# EAGLE design hd6303-mb-ram-rom-x1-ext-dec (EAGLE 9.6.2)

## Sheet 1 of 2
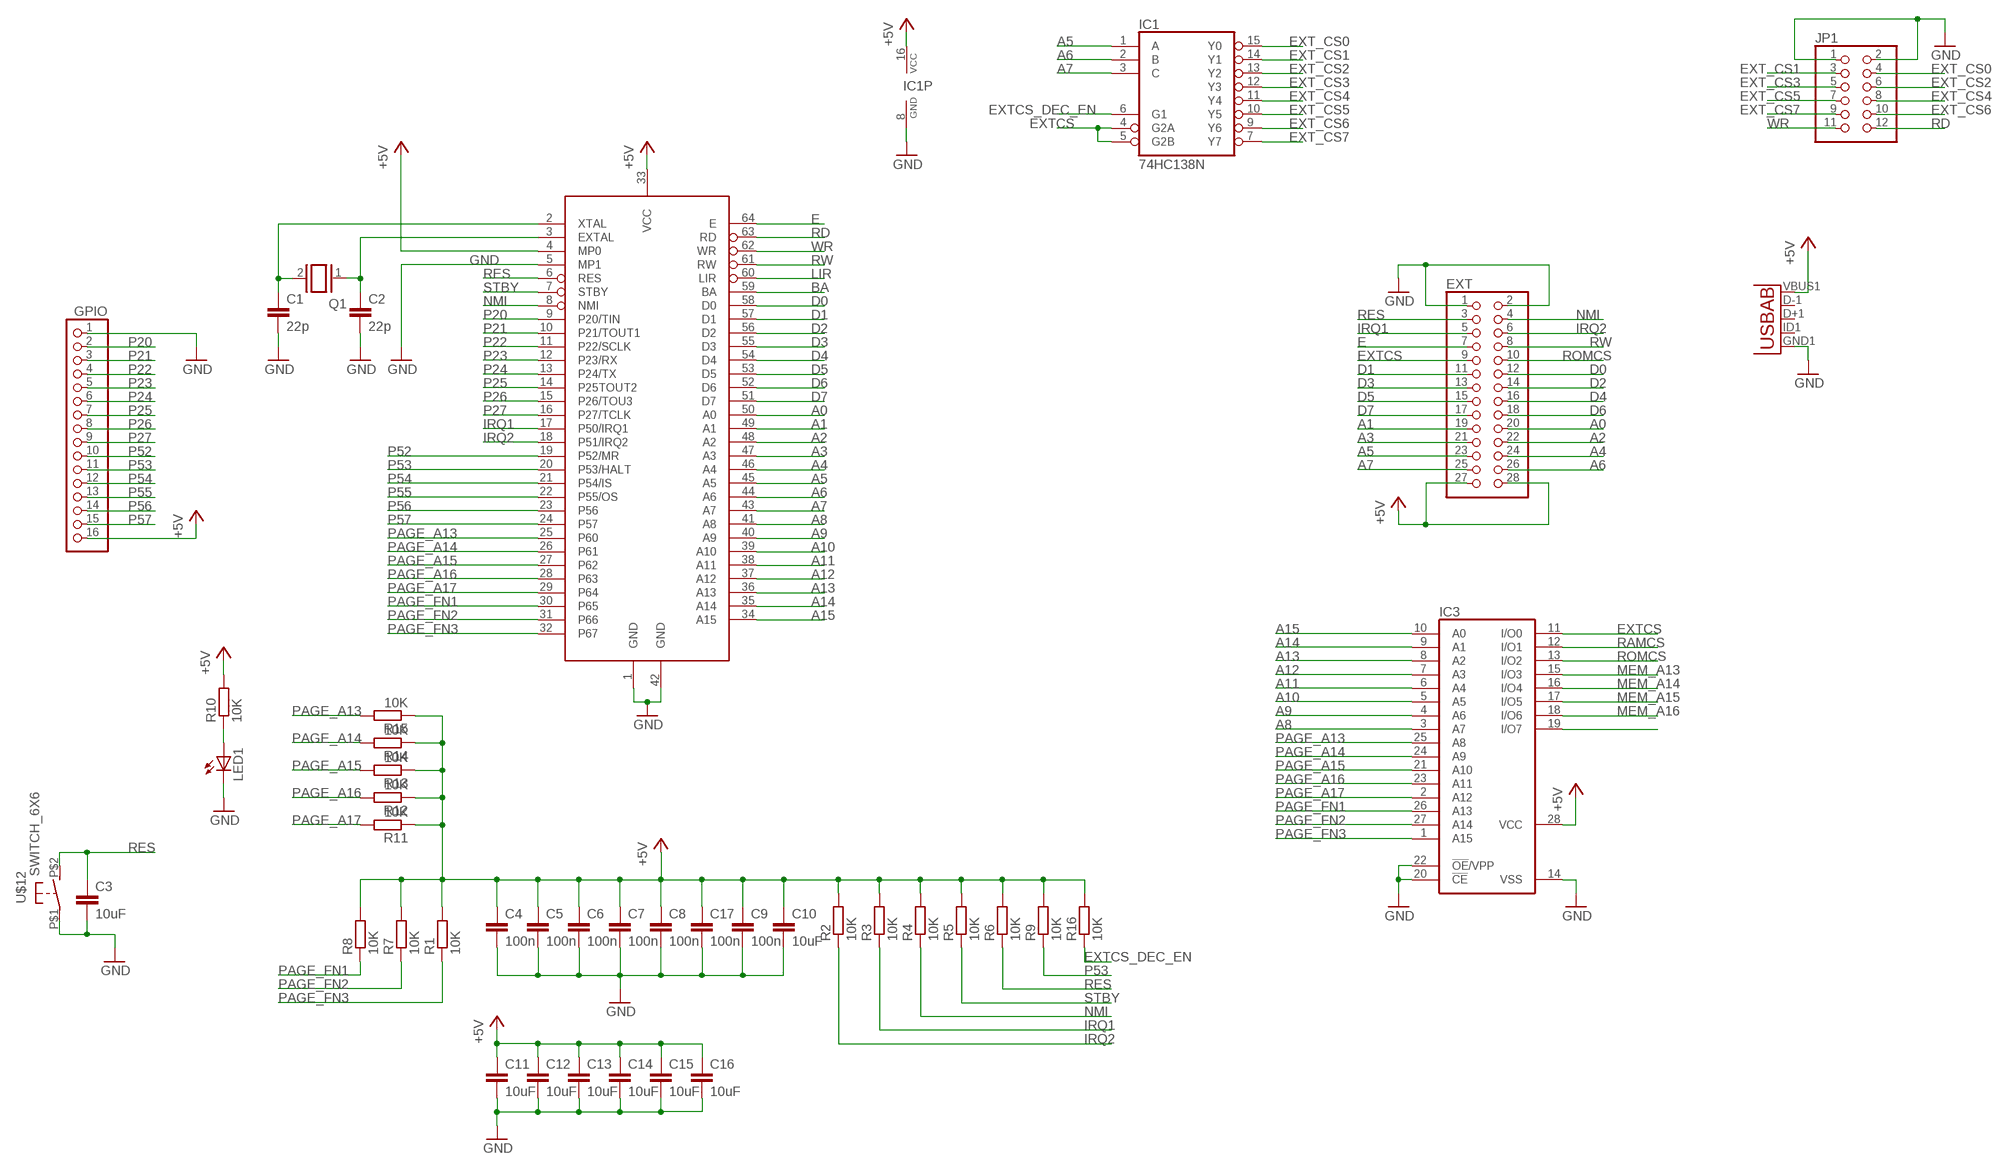
[diagram p0: schematic, sheet 1]

### Parts
C1  22p  C-EUC0603  [C0603]
C2  22p  C-EUC0603  [C0603]
C3  10uF  C-EUC0805  [C0805]
C4  100n  C-EUC0603  [C0603]
C5  100n  C-EUC0603  [C0603]
C6  100n  C-EUC0603  [C0603]
C7  100n  C-EUC0603  [C0603]
C8  100n  C-EUC0603  [C0603]
C9  100n  C-EUC0603  [C0603]
C10  10uF  C-EUC0805  [C0805]
C11  10uF  C-EUC0805  [C0805]
C12  10uF  C-EUC0805  [C0805]
C13  10uF  C-EUC0805  [C0805]
C14  10uF  C-EUC0805  [C0805]
C15  10uF  C-EUC0805  [C0805]
C16  10uF  C-EUC0805  [C0805]
C17  100n  C-EUC0603  [C0603]
EXT  PINHD-2X14  [2X14]
GPIO  PINHD-1X16  [1X16]
IC1  74HC138N  [DIL16]
IC3  27512G  [DIL28-6]
JP1  PINHD-2X6  [2X06]
LED1  LED5MM  [LED5MM]
Q1  XTAL/S  [QS]
R1  10K  R-EU_R0603  [R0603]
R2  10K  R-EU_R0603  [R0603]
R3  10K  R-EU_R0603  [R0603]
R4  10K  R-EU_R0603  [R0603]
R5  10K  R-EU_R0603  [R0603]
R6  10K  R-EU_R0603  [R0603]
R7  10K  R-EU_R0603  [R0603]
R8  10K  R-EU_R0603  [R0603]
R9  10K  R-EU_R0603  [R0603]
R10  10K  R-EU_R0603  [R0603]
R11  10K  R-EU_R0603  [R0603]
R12  10K  R-EU_R0603  [R0603]
R13  10K  R-EU_R0603  [R0603]
R14  10K  R-EU_R0603  [R0603]
R15  10K  R-EU_R0603  [R0603]
R16  10K  R-EU_R0603  [R0603]
U2  USB""  [USB-MICRO-SMD]
U$1  HD6303YCP  [DP-64S]
U$12  SWITCH_6X6  [SWITCH_6X6]

### Nets
+5V [power]: C4.1 C5.1 C6.1 C7.1 C8.1 C9.1 C10.1 C11.1 C12.1 C13.1 C14.1 C15.1 C16.1 C17.1 EXT.27 EXT.28 GPIO.16 IC1.16(VCC) IC3.28(VCC) R1.2 R2.2 R3.2 R4.2 R5.2 R6.2 R7.2 R8.2 R9.2 R10.2 R11.1 R12.1 R13.1 R14.1 R15.1 R16.2 U2.VBUS1(VBUS) U$1.4(MP0) U$1.33(VCC) ; also sheet 2
A0: EXT.20 U$1.50(A0) ; also sheet 2
A1: EXT.19 U$1.49(A1) ; also sheet 2
A2: EXT.22 U$1.48(A2) ; also sheet 2
A3: EXT.21 U$1.47(A3) ; also sheet 2
A4: EXT.24 U$1.46(A4) ; also sheet 2
A5: EXT.23 IC1.1(A) U$1.45(A5) ; also sheet 2
A6: EXT.26 IC1.2(B) U$1.44(A6) ; also sheet 2
A7: EXT.25 IC1.3(C) U$1.43(A7) ; also sheet 2
A8: IC3.3(A7) U$1.41(A8) ; also sheet 2
A9: IC3.4(A6) U$1.40(A9) ; also sheet 2
A10: IC3.5(A5) U$1.39(A10) ; also sheet 2
A11: IC3.6(A4) U$1.38(A11) ; also sheet 2
A12: IC3.7(A3) U$1.37(A12) ; also sheet 2
A13: IC3.8(A2) U$1.36(A13)
A14: IC3.9(A1) U$1.35(A14)
A15: IC3.10(A0) U$1.34(A15)
BA: U$1.59(BA)
D0: EXT.12 U$1.58(D0) ; also sheet 2
D1: EXT.11 U$1.57(D1) ; also sheet 2
D2: EXT.14 U$1.56(D2) ; also sheet 2
D3: EXT.13 U$1.55(D3) ; also sheet 2
D4: EXT.16 U$1.54(D4) ; also sheet 2
D5: EXT.15 U$1.53(D5) ; also sheet 2
D6: EXT.18 U$1.52(D6) ; also sheet 2
D7: EXT.17 U$1.51(D7) ; also sheet 2
E: EXT.7 U$1.64(E)
EXT_CS0: IC1.15(Y0) JP1.4
EXT_CS1: IC1.14(Y1) JP1.3
EXT_CS2: IC1.13(Y2) JP1.6
EXT_CS3: IC1.12(Y3) JP1.5
EXT_CS4: IC1.11(Y4) JP1.8
EXT_CS5: IC1.10(Y5) JP1.7
EXT_CS6: IC1.9(Y6) JP1.10
EXT_CS7: IC1.7(Y7) JP1.9
EXTCS: EXT.9 IC1.4(G2A) IC1.5(G2B) IC3.11(I/O0)
EXTCS_DEC_EN: IC1.6(G1) R16.1
GND [power]: C1.2 C2.2 C3.2 C4.2 C5.2 C6.2 C7.2 C8.2 C9.2 C10.2 C11.2 C12.2 C13.2 C14.2 C15.2 C16.2 C17.2 EXT.1 EXT.2 GPIO.1 IC1.8(GND) IC3.14(VSS) IC3.20(!CE) IC3.22(!OE!/VPP) JP1.1 JP1.2 LED1.K(C) U2.GND1(GND) U$1.1(GND) U$1.5(MP1) U$1.42(GND) U$12.P$1(P) ; also sheet 2
IRQ1: EXT.5 R3.1 U$1.17(P50/IRQ1)
IRQ2: EXT.6 R2.1 U$1.18(P51/IRQ2)
LIR: U$1.60(LIR)
MEM_A13: IC3.15(I/O3) ; also sheet 2
MEM_A14: IC3.16(I/O4) ; also sheet 2
MEM_A15: IC3.17(I/O5) ; also sheet 2
MEM_A16: IC3.18(I/O6) ; also sheet 2
N$1: LED1.A R10.1
N$5: C1.1 Q1.2 U$1.2(XTAL)
N$25: IC3.19(I/O7)
N$30: C2.1 Q1.1 U$1.3(EXTAL)
NMI: EXT.4 R4.1 U$1.8(NMI)
P20: GPIO.2 U$1.9(P20/TIN)
P21: GPIO.3 U$1.10(P21/TOUT1)
P22: GPIO.4 U$1.11(P22/SCLK)
P23: GPIO.5 U$1.12(P23/RX)
P24: GPIO.6 U$1.13(P24/TX)
P25: GPIO.7 U$1.14(P25TOUT2)
P26: GPIO.8 U$1.15(P26/TOU3)
P27: GPIO.9 U$1.16(P27/TCLK)
P52: GPIO.10 U$1.19(P52/MR)
P53: GPIO.11 R9.1 U$1.20(P53/HALT)
P54: GPIO.12 U$1.21(P54/IS)
P55: GPIO.13 U$1.22(P55/OS)
P56: GPIO.14 U$1.23(P56)
P57: GPIO.15 U$1.24(P57)
PAGE_A13: IC3.25(A8) R15.2 U$1.25(P60)
PAGE_A14: IC3.24(A9) R14.2 U$1.26(P61)
PAGE_A15: IC3.21(A10) R13.2 U$1.27(P62)
PAGE_A16: IC3.23(A11) R12.2 U$1.28(P63)
PAGE_A17: IC3.2(A12) R11.2 U$1.29(P64)
PAGE_FN1: IC3.26(A13) R8.1 U$1.30(P65)
PAGE_FN2: IC3.27(A14) R7.1 U$1.31(P66)
PAGE_FN3: IC3.1(A15) R1.1 U$1.32(P67)
RAMCS: IC3.12(I/O1) ; also sheet 2
RD: JP1.12 U$1.63(RD) ; also sheet 2
RES: C3.1 EXT.3 R6.1 U$1.6(RES) U$12.P$2(S)
ROMCS: EXT.10 IC3.13(I/O2) ; also sheet 2
RW: EXT.8 U$1.61(RW)
STBY: R5.1 U$1.7(STBY)
WR: JP1.11 U$1.62(WR) ; also sheet 2
Unconnected: U2.D+1(D+) U2.D-1(D-) U2.ID1(USBID)

## Sheet 2 of 2
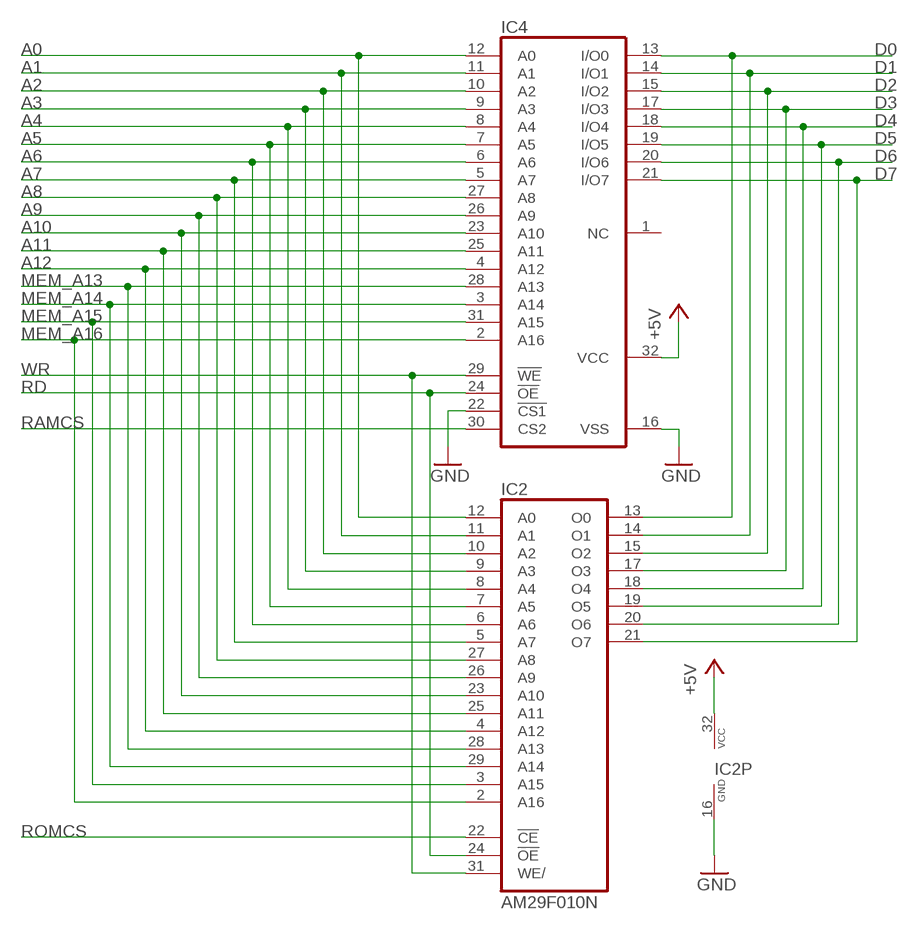
[diagram p1: schematic, sheet 2]

### Parts
IC2  AM29F010N  [DIP32]
IC4  628128P  [DIL32]

### Nets
+5V [power]: IC2.32(VCC) IC4.32(VCC) ; also sheet 1
A0: IC2.12(A0) IC4.12(A0) ; also sheet 1
A1: IC2.11(A1) IC4.11(A1) ; also sheet 1
A2: IC2.10(A2) IC4.10(A2) ; also sheet 1
A3: IC2.9(A3) IC4.9(A3) ; also sheet 1
A4: IC2.8(A4) IC4.8(A4) ; also sheet 1
A5: IC2.7(A5) IC4.7(A5) ; also sheet 1
A6: IC2.6(A6) IC4.6(A6) ; also sheet 1
A7: IC2.5(A7) IC4.5(A7) ; also sheet 1
A8: IC2.27(A8) IC4.27(A8) ; also sheet 1
A9: IC2.26(A9) IC4.26(A9) ; also sheet 1
A10: IC2.23(A10) IC4.23(A10) ; also sheet 1
A11: IC2.25(A11) IC4.25(A11) ; also sheet 1
A12: IC2.4(A12) IC4.4(A12) ; also sheet 1
D0: IC2.13(O0) IC4.13(I/O0) ; also sheet 1
D1: IC2.14(O1) IC4.14(I/O1) ; also sheet 1
D2: IC2.15(O2) IC4.15(I/O2) ; also sheet 1
D3: IC2.17(O3) IC4.17(I/O3) ; also sheet 1
D4: IC2.18(O4) IC4.18(I/O4) ; also sheet 1
D5: IC2.19(O5) IC4.19(I/O5) ; also sheet 1
D6: IC2.20(O6) IC4.20(I/O6) ; also sheet 1
D7: IC2.21(O7) IC4.21(I/O7) ; also sheet 1
GND [power]: IC2.16(GND) IC4.16(VSS) IC4.22(!CS1) ; also sheet 1
MEM_A13: IC2.28(A13) IC4.28(A13) ; also sheet 1
MEM_A14: IC2.29(A14) IC4.3(A14) ; also sheet 1
MEM_A15: IC2.3(A15) IC4.31(A15) ; also sheet 1
MEM_A16: IC2.2(A16) IC4.2(A16) ; also sheet 1
RAMCS: IC4.30(CS2) ; also sheet 1
RD: IC2.24(!OE) IC4.24(!OE) ; also sheet 1
ROMCS: IC2.22(!CE) ; also sheet 1
WR: IC2.31(WE/) IC4.29(!WE) ; also sheet 1
Unconnected: IC2.1(NC) IC2.30(NC) IC4.1(NC)

## Library data of the parts
C1 = rcl:C-EU: CAPACITOR, European symbol; SPICEPREFIX: C
C2 C4-C9 C17 = rcl:C-EU: CAPACITOR, European symbol
C3 C10-C16 = resistor:C-EU: CAPACITOR, European symbol
EXT = pinhead:PINHD-2X14: PIN HEADER
GPIO = pinhead:PINHD-1X16: PIN HEADER
IC1 = 74xx-eu:74*138: 3-line to 8-line DECODER/DEMULTIPLEXER
IC2 = am29-memory:AM29F010*: 1-Megabit FLASH MEMORY (128 K x 8 bit) 5 V-only
IC3 = memory-hitachi:27512G: MEMORY; OC_FARNELL: unknown; OC_NEWARK: unknown
IC4 = memory-hitachi:628128P: MEMORY; OC_FARNELL: unknown; OC_NEWARK: unknown
JP1 = pinhead:PINHD-2X6: PIN HEADER
LED1 = led:LED: LED OSRAM: - CHIPLED LG R971, LG N971, LY N971, LG Q971, LY Q971, LO R971, LY R971 LH N974, LH R974 LS Q976, LO Q976, LY Q976 LO Q996 - Hyper CHIPLED LW Q18S LB Q993, LB Q99A, LB R99A - SideLED LS A670, LO A670, LY A670, LG A670, LP A670 LB A673, LV A673, LT A673, LW A673 LH A674 LY A675 LS A676, LA A676, LO A676, LY A676, LW A676 LS A679, LY A679, LG A679 - Hyper Micro SIDELED® LS Y876, LA Y876, LO Y876, LY Y876 LT Y87S - SmartLED LW L88C, LW L88S LB L89C, LB L89S, LG L890 LS L89K, LO L89K, LY L89K LS L896, LA L896, LO L896, LY L896 - TOPLED LS T670, LO T670, LY T670, LG T670, LP T670 LSG T670, LSP T670, LSY T670, LOP T670, LYG T670 LG T671, LOG T671, LSG T671 LB T673, LV T673, LT T673, LW T673 LH T674 LS T676, LA T676, LO T676, LY T676, LB T676, LH T676, LSB T676, LW T676 LB T67C, LV T67C, LT T67C, LS T67K, LO T67K, LY T67K, LW E67C LS E67B, LA E67B, LO E67B, LY E67B, LB E67C, LV E67C, LT E67C LW T67C LS T679, LY T679, LG T679 LS T770, LO T770, LY T770, LG T770, LP T770 LB T773, LV T773, LT T773, LW T773 LH T774 LS E675, LA E675, LY E675, LS T675 LS T776, LA T776, LO T776, LY T776, LB T776 LHGB T686 LT T68C, LB T68C - Hyper Mini TOPLED® LB M676 - Mini TOPLED Santana® LG M470 LS M47K, LO M47K, LY M47K Source: http://www.osram.convergy.de LUXEON: - LUMILED® LXK2-PW12-R00, LXK2-PW12-S00, LXK2-PW14-U00, LXK2-PW14-V00 LXK2-PM12-R00, LXK2-PM12-S00, LXK2-PM14-U00 LXK2-PE12-Q00, LXK2-PE12-R00, LXK2-PE12-S00, LXK2-PE14-T00, LXK2-PE14-U00 LXK2-PB12-K00, LXK2-PB12-L00, LXK2-PB12-M00, LXK2-PB14-N00, LXK2-PB14-P00, LXK2-PB14-Q00 LXK2-PR12-L00, LXK2-PR12-M00, LXK2-PR14-Q00, LXK2-PR14-R00 LXK2-PD12-Q00, LXK2-PD12-R00, LXK2-PD12-S00 LXK2-PH12-R00, LXK2-PH12-S00 LXK2-PL12-P00, LXK2-PL12-Q00, LXK2-PL12-R00 Source: www.luxeon.com KINGBRIGHT: KA-3528ASYC Source: www.kingbright.com
Q1 = special:XTAL/S: CRYSTAL
R1-R16 = resistor:R-EU_: RESISTOR, European symbol
U2 = MicroUSB:USB: This is a USB AB connector that is compatible with USB OTG. i.e. this connector can serve as a host or device
U$1 = addons-lib:HD6303YCP
U$12 = mouse_enc:SWITCH_6X6

## Net classes
0 default: width 0.152 mm, drill 0.152 mm, clearance 0.152 mm
1 power: width 0.406 mm, drill 0.152 mm, clearance 0.152 mm to class 0, clearance 0.152 mm

## Board
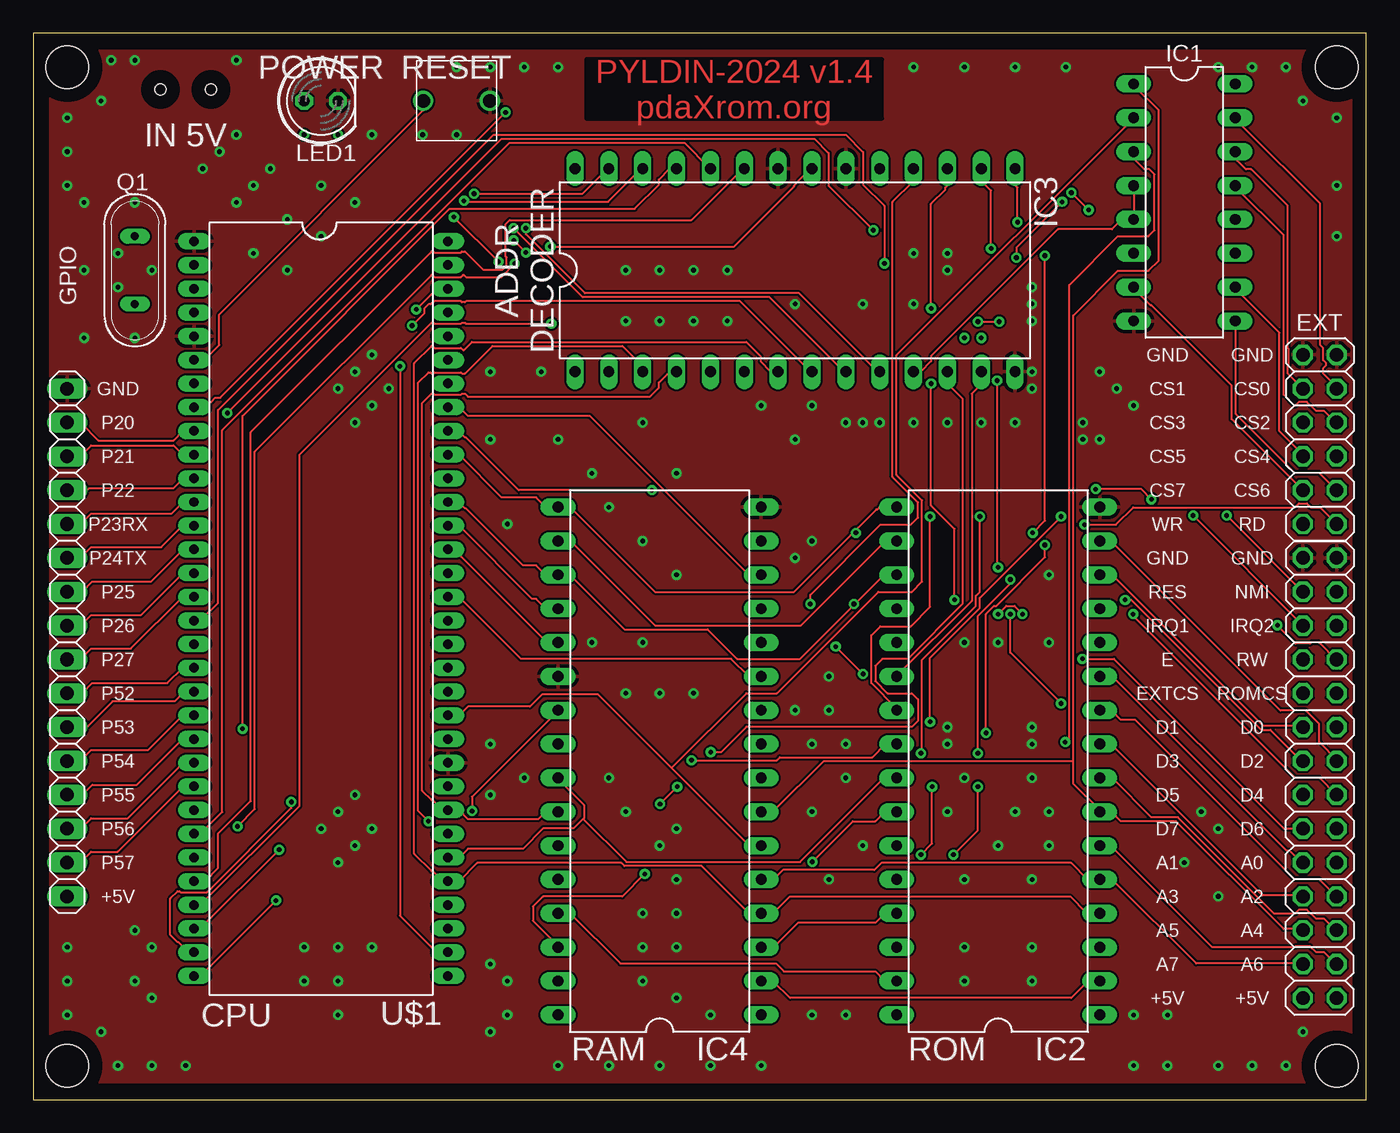
[diagram p2: board, top side]
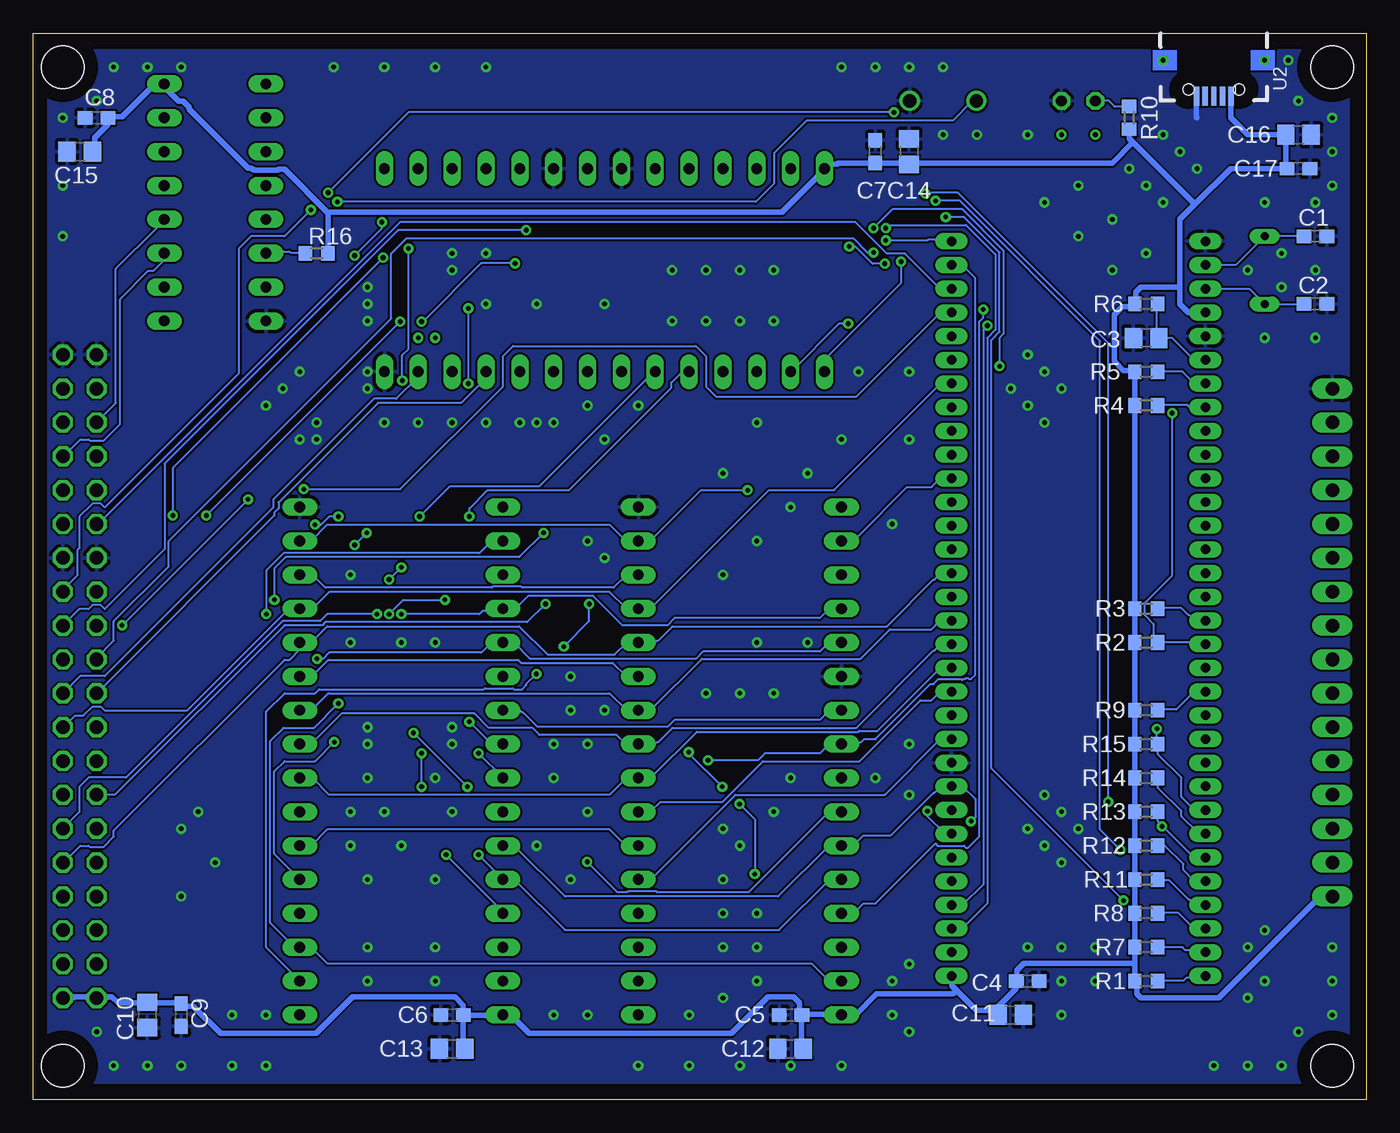
[diagram p3: board, bottom side, seen from below]

Size 100 x 80 mm. Coordinates in mm from the lower left corner, seen from the top.
Outline: 0,0 100,0 100,80 0,80 0,0
Copper layers (1*16): Top 0.035mm / dielectric 1.5mm / Bottom 0.035mm
Design rules "default *": minimum track width 6mil, minimum drill 0.35mm, track to track 6mil, track to pad 6mil, pad to pad 6mil, via to via 6mil, smd to smd 6mil, copper to edge 40mil, drill to drill 6mil, minimum pad ring 10mil, minimum via ring 8mil, stop-mask expansion 4mil, vias tented up to drill 23mil, thermal gap 10mil
Holes 3.2 mm at 2.54,77.47 2.54,2.54 97.79,2.54 97.79,77.47

### Footprints (pad centres in the part's own frame; a part is rotated, then mirrored left to right if it is on the bottom)
C0603 = smd 1.1 x 1: 1 -0.85,0; 2 0.85,0
C0805 = smd 1.3 x 1.5: 1 -0.95,0; 2 0.95,0
2X14 = drill 1.016 octagon: 1 -16.51,-1.27; 2 -16.51,1.27; 3 -13.97,-1.27; 4 -13.97,1.27; 5 -11.43,-1.27; 6 -11.43,1.27; 7 -8.89,-1.27; 8 -8.89,1.27; 9 -6.35,-1.27; 10 -6.35,1.27; 11 -3.81,-1.27; 12 -3.81,1.27; 13 -1.27,-1.27; 14 -1.27,1.27; 15 1.27,-1.27; 16 1.27,1.27; 17 3.81,-1.27; 18 3.81,1.27; 19 6.35,-1.27; 20 6.35,1.27; 21 8.89,-1.27; 22 8.89,1.27; 23 11.43,-1.27; 24 11.43,1.27; 25 13.97,-1.27; 26 13.97,1.27; 27 16.51,-1.27; 28 16.51,1.27
1X16 = drill 1.016 long: 1 -19.05,0; 2 -16.51,0; 3 -13.97,0; 4 -11.43,0; 5 -8.89,0; 6 -6.35,0; 7 -3.81,0; 8 -1.27,0; 9 1.27,0; 10 3.81,0; 11 6.35,0; 12 8.89,0; 13 11.43,0; 14 13.97,0; 15 16.51,0; 16 19.05,0
DIL16 = drill 0.813 long: 1 -8.89,-3.81; 2 -6.35,-3.81; 3 -3.81,-3.81; 4 -1.27,-3.81; 5 1.27,-3.81; 6 3.81,-3.81; 7 6.35,-3.81; 8 8.89,-3.81; 9 8.89,3.81; 10 6.35,3.81; 11 3.81,3.81; 12 1.27,3.81; 13 -1.27,3.81; 14 -3.81,3.81; 15 -6.35,3.81; 16 -8.89,3.81
DIP32 = drill 0.813 long: 1 -19.05,-7.62; 2 -16.51,-7.62; 3 -13.97,-7.62; 4 -11.43,-7.62; 5 -8.89,-7.62; 6 -6.35,-7.62; 7 -3.81,-7.62; 8 -1.27,-7.62; 9 1.27,-7.62; 10 3.81,-7.62; 11 6.35,-7.62; 12 8.89,-7.62; 13 11.43,-7.62; 14 13.97,-7.62; 15 16.51,-7.62; 16 19.05,-7.62; 17 19.05,7.62; 18 16.51,7.62; 19 13.97,7.62; 20 11.43,7.62; 21 8.89,7.62; 22 6.35,7.62; 23 3.81,7.62; 24 1.27,7.62; 25 -1.27,7.62; 26 -3.81,7.62; 27 -6.35,7.62; 28 -8.89,7.62; 29 -11.43,7.62; 30 -13.97,7.62; 31 -16.51,7.62; 32 -19.05,7.62
DIL28-6 = drill 0.813 long: 1 -16.51,-7.62; 2 -13.97,-7.62; 3 -11.43,-7.62; 4 -8.89,-7.62; 5 -6.35,-7.62; 6 -3.81,-7.62; 7 -1.27,-7.62; 8 1.27,-7.62; 9 3.81,-7.62; 10 6.35,-7.62; 11 8.89,-7.62; 12 11.43,-7.62; 13 13.97,-7.62; 14 16.51,-7.62; 15 16.51,7.62; 16 13.97,7.62; 17 11.43,7.62; 18 8.89,7.62; 19 6.35,7.62; 20 3.81,7.62; 21 1.27,7.62; 22 -1.27,7.62; 23 -3.81,7.62; 24 -6.35,7.62; 25 -8.89,7.62; 26 -11.43,7.62; 27 -13.97,7.62; 28 -16.51,7.62
DIL32 = drill 0.813 long: 1 -19.05,-7.62; 2 -16.51,-7.62; 3 -13.97,-7.62; 4 -11.43,-7.62; 5 -8.89,-7.62; 6 -6.35,-7.62; 7 -3.81,-7.62; 8 -1.27,-7.62; 9 1.27,-7.62; 10 3.81,-7.62; 11 6.35,-7.62; 12 8.89,-7.62; 13 11.43,-7.62; 14 13.97,-7.62; 15 16.51,-7.62; 16 19.05,-7.62; 17 19.05,7.62; 18 16.51,7.62; 19 13.97,7.62; 20 11.43,7.62; 21 8.89,7.62; 22 6.35,7.62; 23 3.81,7.62; 24 1.27,7.62; 25 -1.27,7.62; 26 -3.81,7.62; 27 -6.35,7.62; 28 -8.89,7.62; 29 -11.43,7.62; 30 -13.97,7.62; 31 -16.51,7.62; 32 -19.05,7.62
2X06 = drill 1.016 octagon: 1 -6.35,-1.27; 2 -6.35,1.27; 3 -3.81,-1.27; 4 -3.81,1.27; 5 -1.27,-1.27; 6 -1.27,1.27; 7 1.27,-1.27; 8 1.27,1.27; 9 3.81,-1.27; 10 3.81,1.27; 11 6.35,-1.27; 12 6.35,1.27
LED5MM = drill 0.813 octagon: A -1.27,0; K 1.27,0
QS = drill 0.61 long: 1 -2.54,0; 2 2.54,0
R0603 = smd 1 x 1.1: 1 -0.85,0; 2 0.85,0
USB-MICRO-SMD = smd 1.4 x 0.4: D+1 2.7,0; D-1 2.7,0.65; GND1 2.7,-1.3; ID1 2.7,-0.65; VBUS1 2.7,1.3 | hole 0.85: 2.2,1.9; 2.2,-1.9
DP-64S = drill 0.711 long: 1 -27.559,-9.525; 2 -25.781,-9.525; 3 -24.003,-9.525; 4 -22.225,-9.525; 5 -20.447,-9.525; 6 -18.669,-9.525; 7 -16.891,-9.525; 8 -15.113,-9.525; 9 -13.335,-9.525; 10 -11.557,-9.525; 11 -9.779,-9.525; 12 -8.001,-9.525; 13 -6.223,-9.525; 14 -4.445,-9.525; 15 -2.667,-9.525; 16 -0.889,-9.525; 17 0.889,-9.525; 18 2.667,-9.525; 19 4.445,-9.525; 20 6.223,-9.525; 21 8.001,-9.525; 22 9.779,-9.525; 23 11.557,-9.525; 24 13.335,-9.525; 25 15.113,-9.525; 26 16.891,-9.525; 27 18.669,-9.525; 28 20.447,-9.525; 29 22.225,-9.525; 30 24.003,-9.525; 31 25.781,-9.525; 32 27.559,-9.525; 33 27.559,9.525; 34 25.781,9.525; 35 24.003,9.525; 36 22.225,9.525; 37 20.447,9.525; 38 18.669,9.525; 39 16.891,9.525; 40 15.113,9.525; 41 13.335,9.525; 42 11.557,9.525; 43 9.779,9.525; 44 8.001,9.525; 45 6.223,9.525; 46 4.445,9.525; 47 2.667,9.525; 48 0.889,9.525; 49 -0.889,9.525; 50 -2.667,9.525; 51 -4.445,9.525; 52 -6.223,9.525; 53 -8.001,9.525; 54 -9.779,9.525; 55 -11.557,9.525; 56 -13.335,9.525; 57 -15.113,9.525; 58 -16.891,9.525; 59 -18.669,9.525; 60 -20.447,9.525; 61 -22.225,9.525; 62 -24.003,9.525; 63 -25.781,9.525; 64 -27.559,9.525
SWITCH_6X6 = drill 1: P$1 -2.5,0; P$2 2.5,0

### Placement (x,y rotation side)
C1  3.81,64.77 0 bottom
C2  3.81,59.69 0 bottom
C3  16.51,57.15 180 bottom
C4  25.4,8.89 0 bottom
C5  43.18,6.35 180 bottom
C6  68.58,6.35 180 bottom
C7  36.83,71.12 90 bottom
C8  95.25,73.66 180 bottom
C9  88.9,6.35 270 bottom
C10  91.44,6.35 270 bottom
C11  26.67,6.35 0 bottom
C12  43.18,3.81 180 bottom
C13  68.58,3.81 180 bottom
C14  34.29,71.12 90 bottom
C15  96.52,71.12 180 bottom
C16  5.08,72.39 0 bottom
C17  5.08,69.85 0 bottom
EXT  96.52,24.13 270 top
GPIO  2.54,34.29 270 top
IC1  86.36,67.31 270 top
IC2  72.39,25.4 90 top
IC3  57.15,62.23 0 top
IC4  46.99,25.4 90 top
JP1  96.52,49.53 270 top
LED1  21.59,74.93 0 top
Q1  7.62,62.23 90 top
R1  16.51,8.89 180 bottom
R2  16.51,34.29 180 bottom
R3  16.51,36.83 180 bottom
R4  16.51,52.07 180 bottom
R5  16.51,54.61 180 bottom
R6  16.51,59.69 180 bottom
R7  16.51,11.43 180 bottom
R8  16.51,13.97 180 bottom
R9  16.51,29.21 180 bottom
R10  17.78,73.66 270 bottom
R11  16.51,16.51 0 bottom
R12  16.51,19.05 0 bottom
R13  16.51,21.59 0 bottom
R14  16.51,24.13 0 bottom
R15  16.51,26.67 0 bottom
R16  78.74,63.5 0 bottom
U2  11.43,77.98 270 bottom
U$1  21.59,36.83 270 top
U$12  31.75,74.93 180 top

### Tracks (layer width: path | path; a pad name or v marks a point on that pad's centre or on a via)
+5V
  Bottom 0.406: U2.VBUS1 10.16,75.25 10.16,73.66 8.89,72.39 C16.1 6.03,69.95 C17.1 10.16,69.85 12.84,67.17 | 12.84,67.17 13.97,66.04 13.97,60.96 | U$1.4 13.34,59.05 13.97,59.69 13.97,60.96 | C15.1 95.56,71.17 95.4,71.32 95.4,72.16 94.41,73.15 94.41,73.61 C8.1 94.26,73.76 93.34,73.76 91.21,75.89 90.3,75.89 IC1.16 90.14,76.2 90.14,75.97 89.08,74.91 88.77,74.91 88.32,74.45 88.32,74.3 83.9,69.88 83.67,69.88 83.59,69.8 83.52,69.8 83.44,69.72 81.69,69.72 81.61,69.8 81.15,69.8 77.88,66.52 | 77.88,66.52 77.88,63.55 R16.2 | 13.97,60.96 16.92,60.96 17.3,60.58 17.3,59.74 R6.2 17.45,59.51 18.29,59.51 18.9,58.9 18.9,55.4 18.21,54.71 17.53,54.71 R5.2 17.37,54.56 17.37,52.12 R4.2 17.37,51.89 17.37,37.03 R3.2 17.37,36.8 17.37,34.29 R2.2 17.37,34.14 17.37,29.41 R9.2 17.37,29.18 17.37,26.82 R15.1 17.37,26.67 17.37,24.16 R14.1 17.37,23.93 17.37,21.79 R13.1 17.37,21.57 17.37,19.2 R12.1 17.37,19.05 17.37,16.54 R11.1 17.37,16.31 17.37,14.17 R8.2 17.37,13.95 17.37,11.58 R7.2 17.37,11.43 17.37,10.21 | 12.84,67.17 17.49,71.82 | 17.49,71.82 17.75,72.08 17.75,72.77 R10.2 | 17.49,71.82 19.05,70.26 34.14,70.26 C14.1 34.37,70.26 36.8,70.26 C7.1 37.03,70.26 39.62,70.26 39.7,70.18 40.31,70.18 IC3.28 40.69,69.72 43.81,66.6 77.72,66.6 77.88,66.52 | C6.1 67.74,6.33 67.74,3.89 67.67,3.81 C13.1 | C6.1 67.59,6.33 64.77,6.33 IC2.32 64.62,6.25 64.08,6.25 62.79,4.95 47.62,4.95 44.88,7.7 42.98,7.7 42.52,7.24 42.52,6.71 42.37,6.55 C5.1 | EXT.28 97,7.62 96.93,7.7 96.09,7.7 96.01,7.62 EXT.27 94.49,7.62 94.41,7.7 94.11,7.7 93.65,7.24 91.59,7.24 C10.1 91.44,7.24 88.92,7.24 C9.1 88.85,7.01 88.01,7.01 85.95,4.95 78.79,4.95 76.05,7.7 68.35,7.7 67.74,7.09 67.74,6.55 C6.1
  Bottom 0.406: C5.1 42.37,6.33 42.37,3.89 42.29,3.81 C12.1 | C5.1 42.14,6.4 39.4,6.4 IC4.32 39.17,6.33 38.33,6.33 36.73,7.92 31.01,7.92 30.75,8.19 | 30.75,8.19 29.26,6.71 27.81,6.71 C11.1 27.66,6.4 27.66,6.93 26.29,8.31 26.29,8.84 C4.1 26.21,9.07 26.21,9.68 25.68,10.21 17.37,10.21 | 30.75,8.19 31.09,8.53 31.09,9.22 U$1.33 | 17.37,10.21 17.37,8.91 R1.2 17.22,8.76 17.22,7.92 16.92,7.62 11.05,7.62 3.43,15.24 GPIO.16
A0
  Bottom 0.152: U$1.50 31.17,39.47 31.93,39.47 32.38,39.01 32.46,39.01 35.97,35.51 52.05,35.51 53.11,34.44 53.19,34.44 53.34,34.29 IC4.12 55.47,34.29 56.39,33.38 61.42,33.38 63.55,35.51 77.95,35.51 79.17,34.29 IC2.12 80.01,33.76 80.77,32.99 81.15,32.99 93.95,20.19 93.95,19.74 94.72,18.97 95.78,18.97 95.86,19.05 96.47,19.05 97.77,17.75 EXT.20
A1
  Top 0.152: U$1.49 31.93,37.72 36.58,33.07 52.35,33.07 53.65,31.77 54.56,31.77 IC4.11 | IC2.11 80.01,31.7 81,31.7 94.03,18.67 94.26,18.67 95.1,17.83 95.25,17.83 EXT.19
  Bottom 0.152: IC4.11 54.63,31.77 55.55,31.77 56.54,32.77 63.4,32.77 63.63,32.99 77.88,32.99 79.1,31.77 80.01,31.77 IC2.11
A2
  Top 0.152: IC2.10 80.01,29.18 80.92,29.18 81.61,28.5 82.68,28.5 94.64,16.54 96.47,16.54 97.77,15.24 EXT.22
  Bottom 0.152: U$1.48 31.17,35.89 32,35.89 32.61,35.28 35.74,35.28 37.95,33.07 49.84,33.07 53.65,29.26 54.56,29.26 IC4.10 54.63,29.26 55.55,29.26 56.77,30.48 77.88,30.48 79.1,29.26 80.01,29.26 IC2.10
A3
  Top 0.152: IC2.9 80.85,26.67 92.2,15.32 95.17,15.32 EXT.21
  Bottom 0.152: U$1.47 31.17,34.14 31.93,34.14 32.38,33.68 32.46,33.68 38.25,27.89 52.05,27.89 53.11,26.82 53.19,26.82 53.34,26.67 IC4.9 55.55,26.67 56.24,27.36 62.03,27.36 62.56,27.89 65.84,27.89 66.9,28.96 76.89,28.96 79.17,26.67 IC2.9
A4
  Top 0.152: IC2.8 80.01,24.08 81,24.08 83.9,21.18 85.88,21.18 93.12,13.95 94.64,13.95 94.94,14.25 95.56,14.25 96.24,13.56 96.85,13.56 97.77,12.65 EXT.24
  Bottom 0.152: U$1.46 31.93,32.38 36.65,27.66 38.02,27.66 38.1,27.58 50.22,27.58 53.65,24.16 54.56,24.16 IC4.8 54.63,24.08 55.55,24.08 56.77,22.86 77.8,22.86 79.02,24.08 80.01,24.08 IC2.8
A5
  Top 0.152: EXT.23 95.25,12.72 95.17,12.8 93.8,12.8 85.72,20.88 81.61,20.88 80.92,21.57 80.01,21.57 IC2.7 80.01,21.72 78.03,23.7 78.03,25.38 | 78.03,25.38 78.03,58.83 81.38,62.18 83.67,62.18 84.43,62.94 84.43,74.22 82.6,76.05 82.6,76.2 IC1.1 | 78.03,25.38 59.28,25.38 55.55,21.64 54.63,21.64 IC4.7
  Bottom 0.152: U$1.45 31.17,30.56 32,30.56 32.61,29.95 33.45,29.95 38.02,25.38 45.26,25.38 48.31,22.33 52.96,22.33 53.65,21.64 54.56,21.64 IC4.7
A6
  Top 0.152: IC2.6 80.85,19.05 88.47,11.43 94.64,11.43 94.72,11.51 95.78,11.51 96.24,11.05 96.85,11.05 97.77,10.13 EXT.26 | 47.89,24.88 53.72,19.05 IC4.6 | 47.89,24.88 42.37,30.4 38.18,30.4 37.26,29.49 32.61,29.49 32,28.88 31.17,28.88 U$1.44 | 47.89,24.88 53.49,30.48 55.78,30.48 63.4,38.1 65.91,38.1 66.67,38.86 66.67,44.96 64.77,46.86 64.77,55.85 82.53,73.61 IC1.2
  Bottom 0.152: IC2.6 79.17,19.05 77.95,20.27 56.77,20.27 55.55,19.05 IC4.6
A7  (via drill 0.35)
  Top 0.152: EXT.25 95.25,10.21 87.25,10.21 81,16.46 80.01,16.46 IC2.5 80.01,16.54 79.1,16.54 77.88,17.75 63.63,17.75 63.09,17.22 56.24,17.22 55.55,16.54 54.63,16.54 IC4.5 | v77.42,26.82 77.72,27.13 77.72,61.11 81.38,64.77 83.67,64.77 84.12,65.23 84.12,69.42 83.74,69.8 83.36,69.8 82.6,70.56 82.6,71.09 IC1.3
  Bottom 0.152: U$1.43 31.93,27.05 36.12,22.86 47.32,22.86 53.65,16.54 54.56,16.54 IC4.5 | v77.42,26.82 78.87,25.38 81.15,25.38 81.92,24.61 81.92,18.44 80.01,16.54 IC2.5
A8  (via drill 0.35)
  Top 0.152: IC3.3 45.72,55.02 44.2,56.54 34.44,56.54 32.38,54.48 32.16,54.48 32.08,54.56 30.1,54.56 30.02,54.48 29.87,54.48 29.79,54.56 29.64,54.56 28.88,53.8 28.88,21.64 v29.64,20.88
  Bottom 0.152: IC2.27 63.93,19.05 60.12,15.24 44.12,15.24 40.31,19.05 IC4.27 39.32,19.05 39.01,19.36 38.18,19.36 37.72,19.81 35.66,19.81 32.46,23.01 32.38,23.01 31.93,23.47 31.17,23.47 U$1.41 31.09,23.47 30.25,23.47 29.34,22.55 29.34,21.18 v29.64,20.88
A9  (via drill 0.35)
  Top 0.152: IC4.26 39.32,21.57 38.41,21.57 37.87,21.03 32.61,21.03 31.93,21.72 U$1.40 30.71,21.72 29.95,22.48 29.87,22.48 29.18,23.16 29.18,52.27 29.87,52.96 30.02,52.96 30.1,52.88 32.08,52.88 32.16,52.96 32.38,52.96 32.61,52.73 46.25,52.73 46.94,53.42 46.94,53.8 47.7,54.56 48.23,54.56 IC3.4 | v58.45,17.83 61.49,20.88 63.17,20.88 63.86,21.57 64.77,21.57 IC2.26
  Bottom 0.152: v58.45,17.83 56.16,15.54 55.47,15.54 55.4,15.62 53.26,15.62 53.19,15.54 46.33,15.54 40.31,21.57 39.4,21.57 IC4.26
A10  (via drill 0.35)
  Top 0.152: v32.92,21.64 32.92,22.71 39.4,29.18 IC4.23 | v67.28,43.74 67.28,36.96 65.84,35.51 63.55,35.51 62.87,34.82 62.87,31.24 64.77,29.34 IC2.23
  Bottom 0.152: v32.92,21.64 32.92,21.26 31.62,19.96 31.17,19.96 U$1.39 | IC2.23 64.77,29.18 63.48,29.18 63.32,29.03 63.25,29.03 62.18,27.96 52.43,27.96 51.89,28.5 41,28.5 40.31,29.18 39.4,29.18 IC4.23 | v67.28,43.74 67.28,44.35 65.91,45.72 59.82,45.72 52.12,53.42 52.12,53.8 51.36,54.56 50.83,54.56 IC3.5
A11  (via drill 0.35)
  Top 0.152: 41.26,21.07 41.3,21.11 41.3,22.1 39.32,24.08 IC4.25 | 41.26,21.07 40.54,20.34 38.25,20.34 36.73,18.82 32.61,18.82 32,18.21 31.17,18.21 U$1.38 | 41.26,21.07 44.5,17.83 57.53,17.83 63.78,24.08 64.77,24.08 IC2.25 | v71.02,43.74 71.02,38.1 70.71,37.8 70.71,37.03 66.67,32.99 66.67,26.06 v66.6,25.98
  Bottom 0.152: v71.02,43.74 68.73,46.02 62.03,46.02 53.49,54.56 53.34,54.56 IC3.6 | v66.6,25.98 64.77,24.16 IC2.25
A12
  Top 0.152: IC2.4 80.01,14.02 79.02,14.02 77.8,15.24 56.77,15.24 55.55,14.02 54.63,14.02 IC4.4 54.56,14.02 53.65,14.02 50.14,17.53 44.35,17.53 44.12,17.75 33.3,17.75 31.93,16.38 U$1.37 30.71,16.38 29.95,17.14 29.87,17.14 28.57,18.44 28.57,55.24 29.87,56.54 29.95,56.54 30.1,56.39 32.08,56.39 32.23,56.24 32.31,56.24 32.92,56.84 53.49,56.84 54.56,55.78 54.56,55.4 55.32,54.63 55.85,54.63 IC3.7
A13  (via drill 0.35)
  Top 0.152: v28.42,58.06 29.34,58.98 29.34,59.36 29.64,59.66 29.79,59.66 29.95,59.82 30.02,59.82 30.1,59.89 32.08,59.89 32.16,59.82 32.38,59.82 32.46,59.89 53.03,59.89 58.37,54.56 IC3.8
  Bottom 0.152: v28.42,58.06 28.73,57.76 28.73,16.15 30.25,14.63 31.09,14.63 U$1.36
A14  (via drill 0.35)
  Top 0.152: v36.04,65.38 41.22,60.2 55.24,60.2 60.81,54.63 60.96,54.63 IC3.9
  Bottom 0.152: v36.04,65.38 35.81,65.61 30.02,65.61 27.81,63.4 27.81,57.76 28.42,57.15 28.42,14.71 30.25,12.88 31.09,12.88 U$1.35
A15  (via drill 0.35)
  Top 0.152: U$1.34 30.25,11.05 27.51,13.79 v27.51,55.02 | v36.96,65.38 36.96,64.92 41.38,60.5 57.45,60.5 63.32,54.63 63.48,54.63 IC3.10
  Bottom 0.152: v27.51,55.02 27.51,57.15 27.2,57.45 27.2,63.7 30.33,66.83 35.51,66.83 v36.96,65.38
D0
  Bottom 0.152: EXT.12 97.77,27.89 96.85,28.8 96.24,28.8 95.56,29.49 94.94,29.49 94.64,29.18 88.47,29.18 80.85,36.8 80.01,36.8 IC2.13 80.01,36.88 79.02,36.88 77.8,38.1 56.77,38.1 55.55,36.88 54.63,36.88 IC4.13 54.56,36.88 53.65,36.88 44.81,45.72 39.93,45.72 31.93,53.72 U$1.58
D1
  Top 0.152: IC2.14 80.01,39.32 81,39.32 92.28,28.04 95.17,28.04 95.25,27.96 EXT.11 | U$1.57 31.17,51.89 32,51.89 32.61,51.28 41.76,51.28 53.65,39.4 54.56,39.4 IC4.14
  Bottom 0.152: IC2.14 80.01,39.32 79.02,39.32 78.11,38.41 65.61,38.41 65.53,38.48 63.4,38.48 63.32,38.41 56.46,38.41 55.55,39.32 54.63,39.32 IC4.14
D2  (via drill 0.35)
  Top 0.152: v46.41,45.72 36.42,45.72 32.46,49.68 32.38,49.68 31.93,50.14 31.17,50.14 U$1.56 | IC2.15 80.85,41.91 93.57,29.18 95.48,29.18 96.47,28.19 96.47,26.82 97.84,25.45 EXT.14
  Bottom 0.152: v46.41,45.72 49.91,45.72 53.42,42.22 54.25,42.22 54.56,41.91 IC4.15 55.55,41.91 56.77,43.13 77.95,43.13 79.17,41.91 IC2.15
D3  (via drill 0.35)
  Top 0.152: U$1.55 31.93,48.39 35.13,45.19 37.72,45.19 38.41,44.5 39.32,44.5 IC4.17 39.4,44.42 40.31,44.42 46.63,38.1 57.07,38.1 61.61,42.63 | 61.61,42.63 63.25,44.27 63.32,44.27 63.48,44.42 64.77,44.42 IC2.17 | v81.92,37.49 82.37,37.49 92.13,27.74 92.81,27.74 95.1,25.45 95.25,25.45 EXT.13 | 61.61,42.63 v61.72,42.52
  Bottom 0.152: v81.92,37.49 81.92,39.85 81.08,40.69 63.55,40.69 v61.72,42.52
D4  (via drill 0.35)
  Top 0.152: IC2.18 63.93,41.91 57.61,35.59 46.63,35.59 40.31,41.91 IC4.18 | v82.53,36.42 82.53,36.27 94.64,24.16 96.47,24.16 97.77,22.86 EXT.16
  Bottom 0.152: U$1.54 31.17,46.56 32,46.56 32.61,45.95 34.44,45.95 38.18,42.22 39.01,42.22 39.32,41.91 IC4.18 | v82.53,36.42 82.53,39.7 81.23,41 66.52,41 65.61,41.91 IC2.18
D5  (via drill 0.35)
  Top 0.152: U$1.53 31.17,44.81 31.93,44.81 32.38,44.35 32.46,44.35 36.73,40.08 37.72,40.08 38.41,39.4 39.32,39.4 IC4.19 39.4,39.32 40.31,39.32 44.35,35.28 50.6,35.28 52.81,33.07 57.53,33.07 61.61,37.15 | 61.61,37.15 63.78,39.32 64.77,39.32 IC2.19 | v61.57,37.19 61.61,37.15
  Bottom 0.152: EXT.15 93.88,22.86 81.15,35.59 78.33,35.59 78.11,35.81 62.94,35.81 v61.57,37.19
D6  (via drill 0.35)
  Top 0.152: U$1.52 31.93,43.05 37.41,37.57 37.72,37.57 38.41,36.88 39.32,36.88 IC4.20 | v74.22,36.42 73.61,37.03 73,37.03 v72.39,36.42
  Bottom 0.152: IC4.20 39.4,36.8 40.31,36.8 41,36.12 51.89,36.12 52.43,35.59 55.78,35.59 57.99,37.8 62.87,37.8 63.78,36.88 64.77,36.88 IC2.20 64.77,36.8 65.91,36.8 66.06,36.65 66.29,36.65 66.52,36.42 v72.39,36.42 | EXT.18 96.55,21.57 96.55,23.47 95.86,24.16 93.04,24.16 81.31,35.89 78.49,35.89 77.95,36.42 v74.22,36.42
D7  (via drill 0.35)
  Top 0.152: IC4.21 38.56,34.29 31.62,41.22 31.17,41.22 U$1.51 | v78.72,33.07 81.08,33.07 93.8,20.34 95.25,20.34 EXT.17
  Bottom 0.152: IC4.21 40.31,34.29 41,33.6 49.76,33.6 50.29,33.07 62.71,33.07 63.93,34.29 IC2.21 65.61,34.29 66.37,33.53 77.8,33.53 78.26,33.07 v78.72,33.07
E  (via drill 0.35)
  Top 0.152: v36.96,63.55 v36.04,64.47
  Bottom 0.152: U$1.64 32.23,64.39 32.38,64.54 32.84,64.54 32.92,64.47 v36.04,64.47 | v36.96,63.55 37.41,63.55 38.48,64.62 72.01,64.62 73.15,63.48 73.15,58.6 89.84,41.91 89.84,40.01 93.95,35.89 93.95,34.44 95.25,33.15 EXT.7
EXT_CS0
  Top 0.152: IC1.15 90.75,73.08 90.75,73 96.55,67.21 96.55,56.62 96.77,56.39 96.77,55.47 97,55.24 97,55.09 96.77,54.86 96.77,54.48 97.77,53.49 97.77,53.34 JP1.4
EXT_CS1
  Top 0.152: JP1.3 94.11,54.48 94.11,55.02 94.18,55.09 94.18,56.31 94.11,56.39 94.11,67.06 91.36,69.8 90.98,69.8 90.22,70.56 90.22,71.09 IC1.14
EXT_CS2
  Top 0.152: IC1.13 90.22,68.58 90.22,68.43 93.8,64.85 93.8,52.88 94.64,52.05 94.94,52.35 95.56,52.35 96.24,51.66 96.85,51.66 97.77,50.75 JP1.6
EXT_CS3
  Bottom 0.152: IC1.12 90.75,65.46 90.75,65.38 93.8,62.33 93.8,52.27 95.25,50.83 JP1.5
EXT_CS4
  Bottom 0.152: IC1.11 90.22,63.48 90.22,62.94 90.98,62.18 91.36,62.18 93.5,60.05 93.5,50.67 94.72,49.45 95.78,49.45 95.86,49.53 96.47,49.53 97.77,48.23 JP1.8
EXT_CS5
  Top 0.152: JP1.7 95.25,48.39 93.5,50.14 93.5,57.53 90.22,60.81 90.22,60.96 IC1.10
EXT_CS6
  Top 0.152: IC1.9 90.22,58.37 90.22,51.44 94.64,47.02 96.47,47.02 97.77,45.72 JP1.10
EXT_CS7
  Top 0.152: JP1.9 89.92,51.05 89.92,53.57 83.9,59.59 83.82,59.59 82.6,60.81 82.6,60.96 IC1.7
EXTCS
  Top 0.152: IC3.11 66.06,54.63 66.6,54.63 67.36,55.4 67.36,55.78 76.89,65.3 80.92,65.3 81.61,65.99 82.53,65.99 IC1.5 82.6,66.06 82.6,68.58 IC1.4
  Bottom 0.152: EXT.9 81.92,43.81 81.92,44.04 81.61,44.35 81.61,44.81 74.14,52.27 67.89,52.27 66.06,54.1 66.06,54.56 IC3.11
EXTCS_DEC_EN
  Bottom 0.152: R16.1 79.63,63.55 80.7,63.55 80.77,63.63 81.23,63.63 81.31,63.55 82.53,63.55 IC1.6
GND  (via drill 0.35)
  Bottom 0.406: U2.GND1 12.73,73.69 12.7,73.66
  other vias: 44.45,62.23 46.99,62.23 49.53,62.23 52.07,62.23 44.45,58.42 46.99,58.42 49.53,58.42 52.07,58.42 57.15,59.69 62.23,59.69 66.04,59.69 66.04,63.5 68.58,63.5 68.58,62.23 60.96,50.8 62.23,50.8 63.5,50.8 66.04,50.8 68.58,50.8 71.12,50.8 73.66,50.8 78.74,50.8 78.74,49.53 80.01,49.53 80.01,54.61 81.28,53.34 82.55,52.07 74.93,58.42 74.93,54.61 74.93,53.34 74.93,59.69 74.93,60.96 59.69,31.75 69.85,34.29 72.39,34.29 76.2,34.29 76.2,39.37 57.15,29.21 59.69,29.21 68.58,27.94 68.58,26.67 74.93,27.94 74.93,26.67 74.93,24.13 76.2,21.59 73.66,21.59 68.58,21.59 69.85,24.13 58.42,21.59 60.96,24.13 44.45,30.48 46.99,30.48 49.53,30.48 58.42,26.67 60.96,26.67 48.26,20.32 46.99,19.05 48.26,16.51 45.72,13.97 48.26,11.43 45.72,11.43 48.26,13.97 45.72,8.89 48.26,7.62 24.13,50.8 25.4,52.07 26.67,53.34 25.4,55.88 24.13,54.61 22.86,53.34 19.05,62.23 16.51,63.5 19.05,66.04 21.59,64.77 24.13,67.31 21.59,68.58 25.4,72.39 29.21,72.39 31.75,72.39 7.62,12.7 8.89,11.43 7.62,8.89 8.89,7.62 21.59,20.32 22.86,21.59 24.13,22.86 25.4,20.32 24.13,19.05 22.86,17.78 20.32,11.43 22.86,11.43 25.4,11.43 20.32,8.89 22.86,8.89 22.86,6.35 34.29,10.16 35.56,8.89 35.56,6.35 34.29,5.08 5.84,77.98 5.08,74.93 2.54,73.66 2.54,71.12 2.54,68.58 12.7,69.85 13.97,71.12 15.24,72.39 15.24,67.31 16.51,68.58 17.78,69.85 2.54,11.43 2.54,8.89 2.54,6.35 5.08,5.08 6.35,2.54 8.89,2.54 11.43,2.54 82.55,6.35 85.09,6.35 82.55,2.54 85.09,2.54 88.9,2.54 91.44,2.54 93.98,2.54 95.25,5.08 88.9,77.47 91.44,77.47 93.98,77.47 95.25,74.93 97.79,73.66 97.79,68.58 97.79,64.77 66.04,77.47 69.85,77.47 73.66,77.47 77.47,77.47 31.75,77.47 34.29,77.47 36.83,77.47 39.37,77.47 39.37,2.54 43.18,2.54 46.99,2.54 50.8,2.54 54.61,2.54 50.8,6.35 58.42,6.35 60.96,6.35 34.29,54.61 38.1,54.61 34.29,49.53 35.56,43.18 39.37,49.53 41.91,46.99 43.18,44.45 45.72,41.91 48.26,46.99 45.72,50.8 57.15,40.64 58.42,41.91 57.15,49.53 54.61,52.07 58.42,52.07 34.29,22.86 36.83,24.13 34.29,26.67 43.18,24.13 44.45,21.59 41.91,34.29 45.72,34.29 48.26,39.37 59.69,16.51 62.23,19.05 69.85,16.51 72.39,19.05 76.2,19.05 74.93,16.51 69.85,11.43 69.85,8.89 74.93,8.89 74.93,11.43 88.9,15.24 86.36,17.78 87.63,21.59 88.9,20.32 3.81,67.31 7.62,67.31 6.35,63.5 8.89,62.23 3.81,62.23 6.35,60.96 7.62,57.15 3.81,57.15 7.62,77.98 15.24,77.98
  pour Top: 1.27,78.74 99.06,78.74 99.06,1.27 1.27,1.27
  pour Bottom: 1.27,78.74 99.06,78.74 99.06,1.27 1.27,1.27
IRQ1  (via drill 0.35)
  Top 0.152: v87.02,43.81 95.25,35.59 EXT.5 | v70.87,58.37 v72.47,58.37 | v63.86,62.74 63.86,67.06 62.26,68.66 62.26,71.09 60.96,72.39 34.52,72.39 13.87,51.74 13.87,37.26 12.57,35.97 12.12,35.97 U$1.17
  Bottom 0.152: R3.1 15.62,36.88 13.87,36.88 13.34,36.35 13.26,36.35 12.88,35.97 12.12,35.97 U$1.17 | v72.47,58.37 v87.02,43.81 | v70.87,58.37 70.76,58.37 66.4,62.74 v63.86,62.74
IRQ2  (via drill 0.35)
  Top 0.152: v63.02,65.23 59.66,68.58 59.66,71.02 58.6,72.08 35.13,72.08 v14.55,51.51
  Bottom 0.152: U$1.18 12.19,34.29 R2.1 15.7,34.29 15.93,34.52 15.93,35.66 16.61,36.35 16.61,37.26 14.55,39.32 v14.55,51.51 | EXT.6 96.55,36.8 95.86,36.8 95.56,37.11 94.94,37.11 94.64,36.8 90.14,41.3 90.14,47.7 72.62,65.23 v63.02,65.23
MEM_A13  (via drill 0.35)
  Top 0.152: v73.84,65.84 73.84,68.43 73.69,68.58 73.69,69.8 IC3.15 | v75.89,63.32 75.89,43.43 v74.98,42.52 | v75.89,41.6 75.89,40.69 72.24,37.03 72.08,37.03 71.48,36.42 v71.48,27.51 | v67.44,23.47 67.44,19.2 v66.6,18.36
  Bottom 0.152: IC4.28 39.4,16.46 40.31,16.46 44.04,12.72 60.12,12.72 63.86,16.46 64.77,16.46 IC2.28 64.77,16.54 v66.6,18.36 | v73.84,65.84 73.84,65.38 v75.89,63.32 | v75.89,41.6 v74.98,42.52 | v67.44,23.47 v71.48,27.51
MEM_A14  (via drill 0.35)
  Top 0.152: IC4.3 55.55,11.43 57.38,13.26 63.17,13.26 63.86,13.95 64.77,13.95 IC2.29 | v71.86,63.86 71.86,68.2 71.17,68.89 71.17,69.8 IC3.16 | v72.31,53.95 72.31,40.01 v72.39,39.93 | v73.3,39.01 73.3,38.71 70.87,36.27 v70.87,25.98 | v70.87,23.47 70.87,20.19 v69.04,18.36
  Bottom 0.152: v71.86,63.86 71.86,56.31 72.31,55.85 v72.31,53.95 | v73.3,39.01 v72.39,39.93 | v70.87,23.47 v70.87,25.98 | v69.04,18.36 64.77,14.1 IC2.29
MEM_A15  (via drill 0.35)
  Top 0.152: IC3.17 68.58,68.58 68.43,68.43 68.43,68.28 67.36,67.21 v67.36,59.36 | v67.36,53.72 67.36,44.58 69.11,42.82 v69.11,37.49 | v73.3,36.42 73.3,33.53 v77.11,29.72
  Bottom 0.152: IC4.31 39.4,8.91 40.31,8.91 41.6,10.21 77.95,10.21 79.17,11.43 IC2.3 80.39,11.43 82.22,13.26 82.22,26.9 81.23,27.89 78.94,27.89 v77.11,29.72 | v67.36,53.72 v67.36,59.36 | v69.11,37.49 72.24,37.49 v73.3,36.42
MEM_A16  (via drill 0.35)
  Top 0.152: IC4.2 54.63,8.84 55.55,8.84 56.77,7.62 77.88,7.62 79.1,8.84 80.01,8.84 IC2.2 | v58.29,37.19 58.29,37.87 63.55,43.13 65.84,43.13 66.37,43.66 66.37,44.81 64.47,46.71 64.47,67.36 65.99,68.89 65.99,69.8 IC3.18 | v62.26,31.93 v60.2,33.98
  Bottom 0.152: v58.29,37.19 58.29,35.89 v60.2,33.98 | v62.26,31.93 63.02,31.17 63.02,31.09 63.32,30.79 63.93,30.79 64.01,30.86 66.14,30.86 66.22,30.79 78.56,30.79 78.87,30.48 81.15,30.48 82.53,29.11 82.53,11.43 80.01,8.91 IC2.2
N$1
  Bottom 0.152: R10.1 17.83,74.52 18.9,74.52 19.36,74.98 20.27,74.98 LED1.A
N$2  (via drill 0.35)
  other vias: 69.85,57.15
N$3  (via drill 0.35)
  other vias: 71.12,57.15
N$5
  Bottom 0.152: C1.1 Q1.2 9.78,62.61 U$1.2
N$17  (via drill 0.35)
  other vias: 20.32,72.39
N$18  (via drill 0.35)
  other vias: 22.86,72.39
N$30
  Bottom 0.152: U$1.3 8.76,60.83 Q1.1 C2.1
NMI  (via drill 0.35)
  Top 0.152: v77.88,68.05 v79.17,66.75 | v35.43,74.07 14.02,52.65 13.64,52.65 13.34,52.35 13.26,52.35 12.88,51.97 12.12,51.97 U$1.8
  Bottom 0.152: R4.1 15.62,52.12 13.41,52.12 13.26,51.97 12.12,51.97 U$1.8 | v79.17,66.75 81.15,64.77 83.67,64.77 84.58,63.86 84.58,54.48 94.64,44.42 94.94,44.73 95.56,44.73 96.55,43.74 96.55,41.38 96.7,41.22 96.7,39.32 97.77,38.25 97.77,38.1 EXT.4 | v77.88,68.05 71.86,74.07 v35.43,74.07
P20
  Top 0.152: U$1.9 12.04,50.14 11.2,50.14 10.52,49.45 4.88,49.45 3.58,50.75 2.59,50.75 GPIO.2
P21
  Top 0.152: U$1.10 11.2,48.39 10.52,49.07 4.34,49.07 3.58,48.31 2.59,48.31 GPIO.3
P22
  Top 0.152: GPIO.4 4.04,45.72 4.19,45.87 10.52,45.87 11.2,46.56 12.04,46.56 U$1.11
P23
  Top 0.152: U$1.12 12.04,44.81 11.2,44.81 10.36,43.97 4.34,43.97 3.58,43.2 2.59,43.2 GPIO.5
P24
  Top 0.152: U$1.13 11.2,43.05 9.6,41.45 4.34,41.45 3.58,40.69 2.59,40.69 GPIO.6
P25
  Top 0.152: GPIO.7 3.66,38.1 4.42,38.86 8.84,38.86 11.2,41.22 12.04,41.22 U$1.14
P26
  Top 0.152: U$1.15 12.04,39.47 11.2,39.47 8.08,36.35 4.34,36.35 3.58,35.59 2.59,35.59 GPIO.8
P27
  Top 0.152: U$1.16 11.2,37.72 7.32,33.83 4.34,33.83 3.58,33.07 2.59,33.07 GPIO.9
P52
  Top 0.152: U$1.19 11.2,32.38 10.06,31.24 4.42,31.24 3.66,30.48 GPIO.10
P53
  Top 0.152: GPIO.11 2.59,27.96 4.04,27.96 5.94,29.87 10.59,29.87 10.97,30.25 11.73,30.25 12.04,30.56 U$1.20
  Bottom 0.152: R9.1 15.62,29.26 14.25,29.26 12.95,30.56 12.12,30.56 U$1.20
P54
  Top 0.152: U$1.21 12.04,28.8 11.2,28.8 8.61,26.21 4.34,26.21 3.58,25.45 2.59,25.45 GPIO.12
P55
  Top 0.152: U$1.22 11.2,27.05 7.77,23.62 4.42,23.62 3.66,22.86 GPIO.13
P56
  Top 0.152: U$1.23 12.04,25.22 11.2,25.22 7.09,21.11 4.34,21.11 3.58,20.34 2.59,20.34 GPIO.14
P57
  Top 0.152: U$1.24 12.04,23.47 11.2,23.47 6.33,18.59 4.34,18.59 3.58,17.83 2.59,17.83 GPIO.15
PAGE_A13  (via drill 0.35)
  Top 0.152: v15.7,27.81 15.7,51.28 31.24,66.83 45.11,66.83 46.94,68.66 46.94,69.04 47.7,69.8 48.23,69.8 IC3.25
  Bottom 0.152: U$1.25 12.88,21.72 13.87,22.71 13.87,24.16 15.62,25.91 15.62,26.67 R15.2 15.7,26.67 v15.7,27.81
PAGE_A14
  Top 0.152: IC3.24 50.75,69.88 48.84,71.78 35.74,71.78 14.17,50.22 14.17,21.57 12.57,19.96 12.12,19.96 U$1.26
  Bottom 0.152: R14.2 15.62,24.08 15.62,23.39 13.87,21.64 13.87,21.26 12.57,19.96 12.12,19.96 U$1.26
PAGE_A15  (via drill 0.35)
  Top 0.152: IC3.21 57.84,69.27 57.76,69.27 57.07,68.58 57.07,68.5 52.58,64.01 v38.79,64.01 | v36.12,62.71 35.13,61.72 32.46,61.72 32.31,61.87 32.23,61.87 32.08,61.72 30.1,61.72 29.95,61.87 29.87,61.87 16.61,48.62 16.61,21.79 v15.32,20.5
  Bottom 0.152: 15.28,20.54 12.95,18.21 12.12,18.21 U$1.27 | 15.28,20.54 15.62,20.88 15.62,21.57 R13.2 | v38.79,64.01 38.33,64.01 37.03,62.71 v36.12,62.71 | v15.32,20.5 15.28,20.54
PAGE_A16
  Top 0.152: U$1.28 12.88,16.38 13.87,17.37 13.87,19.96 16.31,22.4 16.31,50.06 29.87,63.63 30.02,63.63 30.1,63.55 32.08,63.55 32.16,63.63 32.38,63.63 33.76,62.26 35.2,62.26 35.51,62.56 35.51,63.17 35.43,63.25 35.43,65.68 35.74,65.99 49.38,65.99 53.19,69.8 53.34,69.8 IC3.23
  Bottom 0.152: R12.2 15.09,19.05 13.72,17.68 13.72,17.22 12.88,16.38 U$1.28
PAGE_A17  (via drill 0.35)
  Top 0.152: v38.86,58.22 32.46,58.22 32.38,58.29 32.16,58.29 32.08,58.22 30.1,58.22 30.02,58.29 29.87,58.29 19.96,48.39 19.96,22.02 12.57,14.63 12.12,14.63 U$1.29
  Bottom 0.152: R11.2 15.62,16.46 14.78,16.46 13.34,15.01 13.26,15.01 12.88,14.63 12.12,14.63 U$1.29 | v38.86,58.22 39.55,58.22 43.13,54.63 IC3.2
PAGE_FN1  (via drill 0.35)
  Top 0.152: v32.31,67.44 32.38,67.36 43.13,67.36 45.57,69.8 45.72,69.8 IC3.26 | v18.44,18.75 12.57,12.88 12.12,12.88 U$1.30
  Bottom 0.152: R8.1 15.62,14.02 14.1,14.02 12.95,12.88 12.12,12.88 U$1.30 | v32.31,67.44 30.48,67.44 19.96,56.92 19.96,20.27 v18.44,18.75
PAGE_FN2  (via drill 0.35)
  Top 0.152: IC3.27 42.6,69.27 42.52,69.27 41.22,67.97 v33.07,67.97 | v19.36,22.33 19.36,21.87 13.03,15.54 11.05,15.54 10.97,15.62 10.82,15.62 10.29,15.09 10.29,12.34 10.82,11.81 10.9,11.81 11.66,11.05 U$1.31
  Bottom 0.152: R7.1 13.79,11.43 13.56,11.2 12.27,11.2 12.12,11.05 U$1.31 | v33.07,67.97 32.69,67.97 32.61,68.05 30.63,68.05 19.36,56.77 v19.36,22.33
PAGE_FN3  (via drill 0.35)
  Top 0.152: v31.55,66.22 v34.9,62.87 | v18.21,14.94 12.57,9.3 12.12,9.3 U$1.32
  Bottom 0.152: U$1.32 12.19,9.14 13.49,9.14 13.72,8.91 15.62,8.91 R1.1 | v34.9,62.87 34.9,61.27 40.62,55.55 40.62,54.63 IC3.1 | v31.55,66.22 30.18,66.22 27.51,63.55 27.51,57.61 28.12,57 28.12,24.84 v18.21,14.94
RAMCS  (via drill 0.35)
  Top 0.152: v45.87,16.92 44.2,15.24 38.25,15.24 37.49,14.48 37.49,13.41 39.32,11.58 39.32,11.43 IC4.30 | v48.31,23.47 v47.02,22.17 | v50.83,26.06 51.59,26.06 53.49,27.96 65.91,27.96 66.37,28.42 66.37,30.02 65.91,30.48 64.08,30.48 63.17,31.39 63.17,32.54 63.7,33.07 65.61,33.07 69.72,37.19 69.72,52.58 68.89,53.42 68.89,54.25 68.58,54.56 IC3.12
  Bottom 0.152: v45.87,16.92 45.87,21.03 v47.02,22.17 | v48.31,23.47 50.83,25.98 v50.83,26.06
RD  (via drill 0.35)
  Top 0.152: IC2.24 63.93,26.67 62.94,25.68 56.01,25.68 55.78,25.45 v49.38,25.45 | JP1.12 96.55,44.42 95.86,44.42 95.56,44.73 94.94,44.73 94.64,44.42 82.53,44.42 81.23,43.13 v78.87,43.13 | v77.11,43.74 71.02,37.64 71.02,36.88 67.28,33.15 v67.28,28.35
  Bottom 0.152: U$1.63 31.09,62.56 30.25,62.56 29.34,61.65 29.34,31.85 29.64,31.55 29.79,31.55 29.87,31.62 30.02,31.62 30.1,31.55 30.25,31.55 30.33,31.47 30.4,31.55 32.08,31.55 32.46,31.17 32.69,31.17 36.8,27.05 37.64,27.05 37.87,26.82 37.95,26.82 38.1,26.67 IC4.24 40.31,26.67 41,25.98 45.11,25.98 45.64,25.45 v49.38,25.45 | v78.87,43.13 78.41,43.13 77.8,43.74 v77.11,43.74 | v67.28,28.35 65.61,26.67 IC2.24
RES  (via drill 0.35)
  Top 0.152: U$12.P$2 29.26,74.91 29.26,74.22 13.95,58.9 13.95,56.62 12.88,55.55 12.12,55.55 U$1.6 | v89.53,43.81 EXT.3 | v73.76,63.17 73.76,63.93 v77.19,67.36
  Bottom 0.152: R6.1 15.7,59.66 15.7,57.23 15.62,57.15 C3.1 14.55,57.15 12.95,55.55 12.12,55.55 U$1.6 | v89.53,43.81 89.53,47.4 v73.76,63.17 | v77.19,67.36 45.8,67.36 44.42,68.73 44.42,71.02 41.99,73.46 31.01,73.46 29.57,74.91 29.26,74.91 U$12.P$2
ROMCS
  Top 0.152: IC2.22 64.77,31.77 70.41,37.41 70.41,52.96 71.09,53.65 71.09,54.56 IC3.13
  Bottom 0.152: EXT.10 97.77,30.48 96.47,31.77 94.64,31.77 81.99,44.42 81.99,45.03 74.45,52.58 72.77,52.58 71.17,54.18 71.17,54.56 IC3.13
RW  (via drill 0.35)
  Top 0.152: v79.7,45.8 83.13,45.8 v83.9,45.03 | v93.34,35.59 94.72,34.21 95.78,34.21 95.86,34.29 96.47,34.29 97.77,32.99 EXT.8
  Bottom 0.152: U$1.61 31.93,59.05 38.25,52.73 48.77,52.73 49.53,53.49 49.53,55.78 50.29,56.54 64.01,56.54 64.77,55.78 64.77,53.49 72.47,45.8 v79.7,45.8 | v93.34,35.59 v83.9,45.03
STBY
  Bottom 0.152: U$1.7 12.88,53.72 13.79,54.63 15.62,54.63 R5.1
WR  (via drill 0.35)
  Top 0.152: v28.73,59.28 30.25,60.81 31.09,60.81 U$1.62 | IC2.31 64.77,8.91 63.86,8.91 63.17,9.6 56.31,9.6 55.7,10.21 44.04,10.21 40.31,13.95 39.4,13.95 IC4.29
  Bottom 0.152: v28.73,59.28 28.73,58.67 29.03,58.37 29.03,19.74 29.87,18.9 30.02,18.9 30.18,19.05 32.16,19.05 32.31,19.2 36.8,14.71 37.72,14.71 38.41,14.02 39.32,14.02 IC4.29 | JP1.11 95.25,43.2 95.1,43.2 72.47,65.84 38.33,65.84 35.97,63.48 34.59,63.48 32,60.88 31.17,60.88 U$1.62

### Text on the board
Top: PYLDIN-2024 v1.4 / pdaXrom.org
tPlace: POWER | RESET | IN 5V | ADDR / DECODER | GND | GND | GND | CS1 | CS0 | P20 | CS3 | CS2 | P21 | CS5 | CS4 | P22 | CS7 | CS6 | P23RX | WR | RD | P24TX | GND | GND | P25 | RES | NMI | P26 | IRQ1 | IRQ2 | P27 | E | RW | P52 | EXTCS | ROMCS | P53 | D1 | D0 | P54 | D3 | D2 | P55 | D5 | D4 | P56 | D7 | D6 | P57 | A1 | A0 | +5V | A3 | A2 | A5 | A4 | A7 | A6 | +5V | +5V | CPU | RAM | ROM